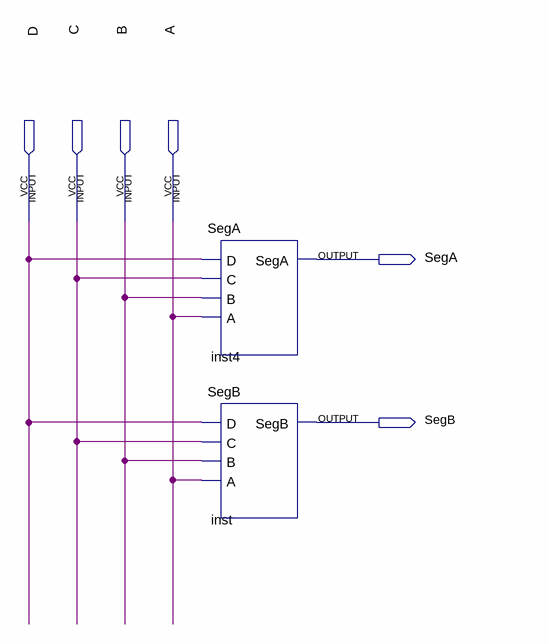
[diagram p0: schematic sheet]
// Quartus schematic SegComplete.bdf as structural Verilog: 2 symbols, 6 pins
module SegComplete (
  input  D,
  input  C,
  input  B,
  input  A,
  output SegA,
  output SegB
);

  SegA inst4 (.D(D), .C(C), .B(B), .A(A), .SegA(SegA));
  SegB inst (.D(D), .C(C), .B(B), .A(A), .SegB(SegB));
endmodule
